# Altium schematic sheet Connectors.SchDoc
size A; SheetNumber: 2; SheetTotal: 5
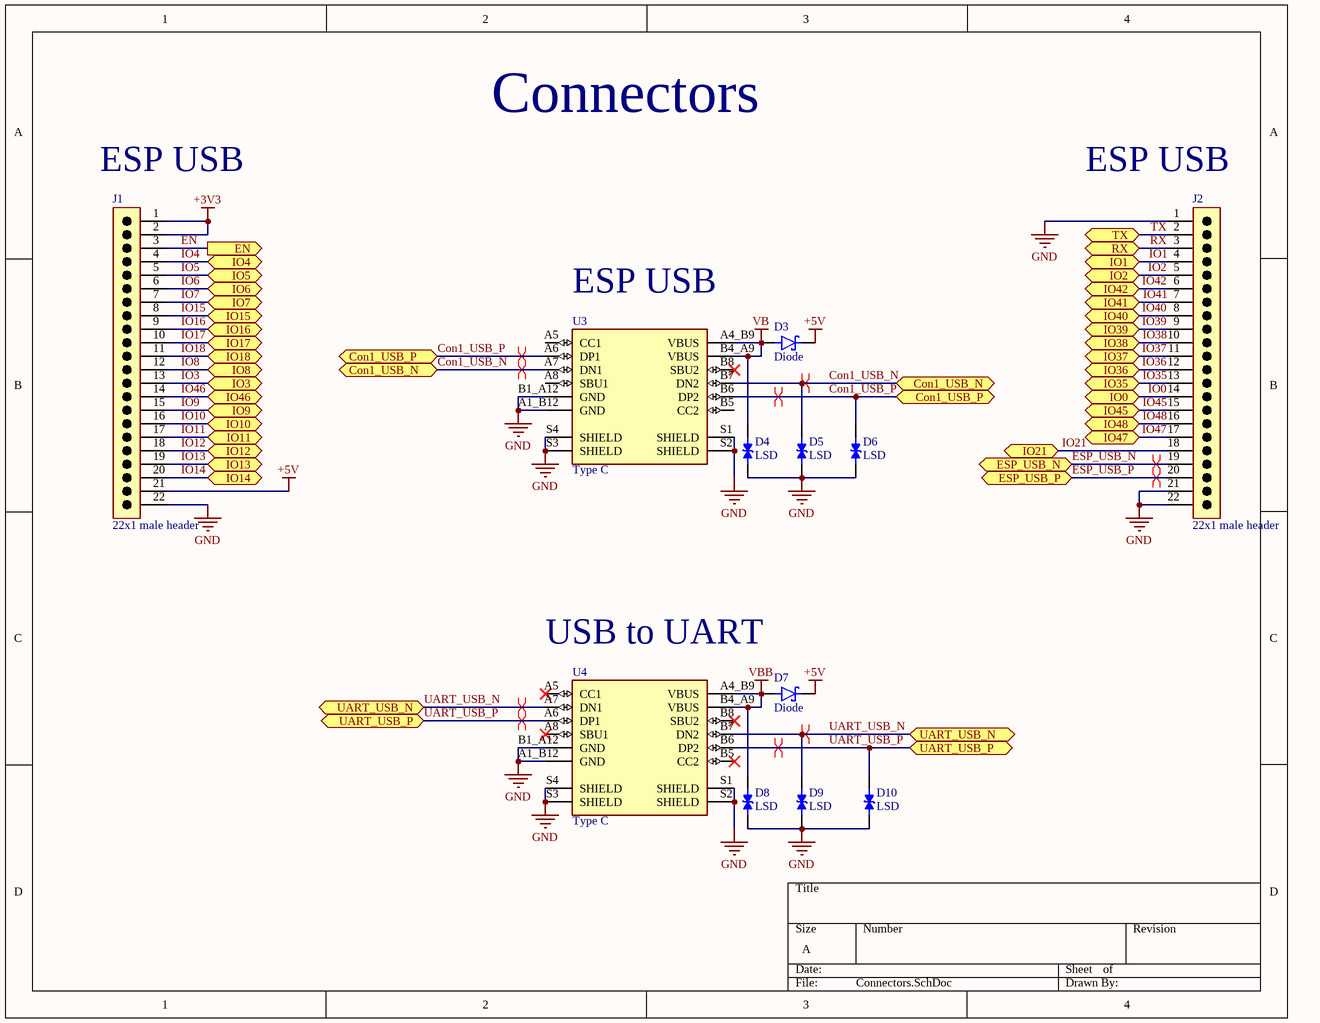
[diagram p0: Connectors.SchDoc]

## Parts
D3  Diode  [Diode]
D4  LSD  [LSD]
D5  LSD  [LSD]
D6  LSD  [LSD]
D7  Diode  [Diode]
D8  LSD  [LSD]
D9  LSD  [LSD]
D10  LSD  [LSD]
J1  22x1 male header  [PCBComponent_1]
J2  22x1 male header  [PCBComponent_1]
U3  Type C  [Type C]
U4  Type C  [Type C]

## Ports
Con1_USB_N (bidir, see Connectors[2B], MCU Module[3B]), Con1_USB_N (bidir, see Connectors[3B], MCU Module[3B]), Con1_USB_P (bidir, see Connectors[2B], MCU Module[3B]), Con1_USB_P (bidir, see Connectors[3B], MCU Module[3B]), EN (out, see MCU Module[2B], MCU Module[2C], Power Circuit[2C], USB to UART[4B]), ESP_USB_N (bidir, see MCU Module[3B]), ESP_USB_P (bidir, see MCU Module[3B]), IO0 (bidir, see MCU Module[2B], Power Circuit[3C], USB to UART[4C]), IO1 (bidir, see MCU Module[2B]), IO2 (bidir, see MCU Module[2B]), IO3 (bidir, see MCU Module[2B]), IO4 (bidir, see MCU Module[2C]), IO5 (bidir, see MCU Module[2C]), IO6 (bidir, see MCU Module[2C]), IO7 (bidir, see MCU Module[2C]), IO8 (bidir, see MCU Module[2C]), IO9 (bidir, see MCU Module[2C]), IO10 (bidir, see MCU Module[2C]), IO11 (bidir, see MCU Module[2C]), IO12 (bidir, see MCU Module[2C]), IO13 (bidir, see MCU Module[2C], MCU Module[3C]), IO14 (bidir, see MCU Module[2C]), IO15 (bidir, see MCU Module[2C]), IO16 (bidir, see MCU Module[2C]), IO17 (bidir, see MCU Module[3B]), IO18 (bidir, see MCU Module[3B]), IO21 (bidir, see MCU Module[3B]), IO35 (bidir, see MCU Module[3B]), IO36 (bidir, see MCU Module[3C]), IO37 (bidir, see MCU Module[3C]), IO38 (bidir, see MCU Module[3C]), IO39 (bidir, see MCU Module[3C]), IO40 (bidir, see MCU Module[3C], Peripherals[2B]), IO41 (bidir, see MCU Module[3C]), IO42 (bidir, see MCU Module[3C]), IO45 (bidir, see MCU Module[3C]), IO46 (bidir, see MCU Module[3C]), IO47 (bidir, see MCU Module[3C]), IO48 (bidir, see MCU Module[3C]), RX (bidir, see MCU Module[2B], USB to UART[3B]), TX (bidir, see MCU Module[2B], USB to UART[3B]), UART_USB_N (bidir, see Connectors[1C], USB to UART[1B]), UART_USB_N (bidir, see Connectors[3C], USB to UART[1B]), UART_USB_P (bidir, see Connectors[1C], USB to UART[1B]), UART_USB_P (bidir, see Connectors[3C], USB to UART[1B])

## Nets
+3V3: J1.1 J1.2
+5V: D3.C(K) D7.C(K) J1.21
GND: D4.1 D5.1 D6.1 D8.1 D9.1 D10.1 J1.22 J2.1 J2.21 J2.22 U3.A1_B12(GND) U3.B1_A12(GND) U3.S1(SHIELD) U3.S2(SHIELD) U3.S3(SHIELD) U3.S4(SHIELD) U4.A1_B12(GND) U4.B1_A12(GND) U4.S1(SHIELD) U4.S2(SHIELD) U4.S3(SHIELD) U4.S4(SHIELD)
VB: D3.A D4.2 U3.A4_B9(VBUS) U3.B4_A9(VBUS)
VBB: D7.A D8.2 U4.A4_B9(VBUS) U4.B4_A9(VBUS)
Con1_USB_N: D5.2 U3.A7(DN1) U3.B7(DN2) ; port Con1_USB_N
Con1_USB_P: D6.2 U3.A6(DP1) U3.B6(DP2) ; port Con1_USB_P
EN: J1.3 ; port EN
ESP_USB_N: J2.19 ; port ESP_USB_N
ESP_USB_P: J2.20 ; port ESP_USB_P
IO0: J2.14 ; port IO0
IO1: J2.4 ; port IO1
IO2: J2.5 ; port IO2
IO3: J1.13 ; port IO3
IO4: J1.4 ; port IO4
IO5: J1.5 ; port IO5
IO6: J1.6 ; port IO6
IO7: J1.7 ; port IO7
IO8: J1.12 ; port IO8
IO9: J1.15 ; port IO9
IO10: J1.16 ; port IO10
IO11: J1.17 ; port IO11
IO12: J1.18 ; port IO12
IO13: J1.19 ; port IO13
IO14: J1.20 ; port IO14
IO15: J1.8 ; port IO15
IO16: J1.9 ; port IO16
IO17: J1.10 ; port IO17
IO18: J1.11 ; port IO18
IO21: J2.18 ; port IO21
IO35: J2.13 ; port IO35
IO36: J2.12 ; port IO36
IO37: J2.11 ; port IO37
IO38: J2.10 ; port IO38
IO39: J2.9 ; port IO39
IO40: J2.8 ; port IO40
IO41: J2.7 ; port IO41
IO42: J2.6 ; port IO42
IO45: J2.15 ; port IO45
IO46: J1.14 ; port IO46
IO47: J2.17 ; port IO47
IO48: J2.16 ; port IO48
RX: J2.3 ; port RX
TX: J2.2 ; port TX
UART_USB_N: D9.2 U4.A7(DN1) U4.B7(DN2) ; port UART_USB_N
UART_USB_P: D10.2 U4.A6(DP1) U4.B6(DP2) ; port UART_USB_P

Not connected (* = marked no-connect by the designer): U3 A5(CC1) A8(SBU1) B5(CC2) B8(SBU2)*; U4 A5(CC1)* A8(SBU1)* B5(CC2)* B8(SBU2)*

## Layout directives
differential pair; differential pair class DIFF90: Con1_USB_N, Con1_USB_P, ESP_USB_N, ESP_USB_P, UART_USB_N, UART_USB_P

## Notes on the sheet
- Connectors
- (near J1) ESP USB
- (near J2) ESP USB
- (near U3) ESP USB
- USB to UART

## Library data of the parts
U3 U4 = Type C: USB Connectors 24 Receptacle 1 8.94*7.3mm RoHS